# EAGLE design ToolHead (EAGLE 9.4.2)
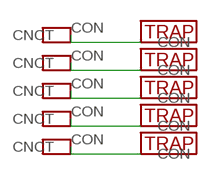
[diagram p0: schematic, sheet 1]

## Parts
U$1  MOLEX-LITE-TRAP  [MOLEX-LITE-TRAP]
U$2  MOLEX-LITE-TRAP  [MOLEX-LITE-TRAP]
U$3  MOLEX-LITE-TRAP  [MOLEX-LITE-TRAP]
U$4  MOLEX-LITE-TRAP  [MOLEX-LITE-TRAP]
U$5  MOLEX-LITE-TRAP  [MOLEX-LITE-TRAP]
U$6  SPRING-FINGER  [SPRING-FINGER]
U$7  SPRING-FINGER  [SPRING-FINGER]
U$8  SPRING-FINGER  [SPRING-FINGER]
U$9  SPRING-FINGER  [SPRING-FINGER]
U$10  SPRING-FINGER  [SPRING-FINGER]

## Nets
N$1: U$4.TRAP(CON) U$10.CON(CNCT)
N$2: U$3.TRAP(CON) U$9.CON(CNCT)
N$3: U$2.TRAP(CON) U$8.CON(CNCT)
N$4: U$1.TRAP(CON) U$7.CON(CNCT)
N$5: U$5.TRAP(CON) U$6.CON(CNCT)

## Library data of the parts
U$1-U$5 = MolexLiteTrap:MOLEX-LITE-TRAP
U$6-U$10 = MolexLiteTrap:SPRING-FINGER

## Board
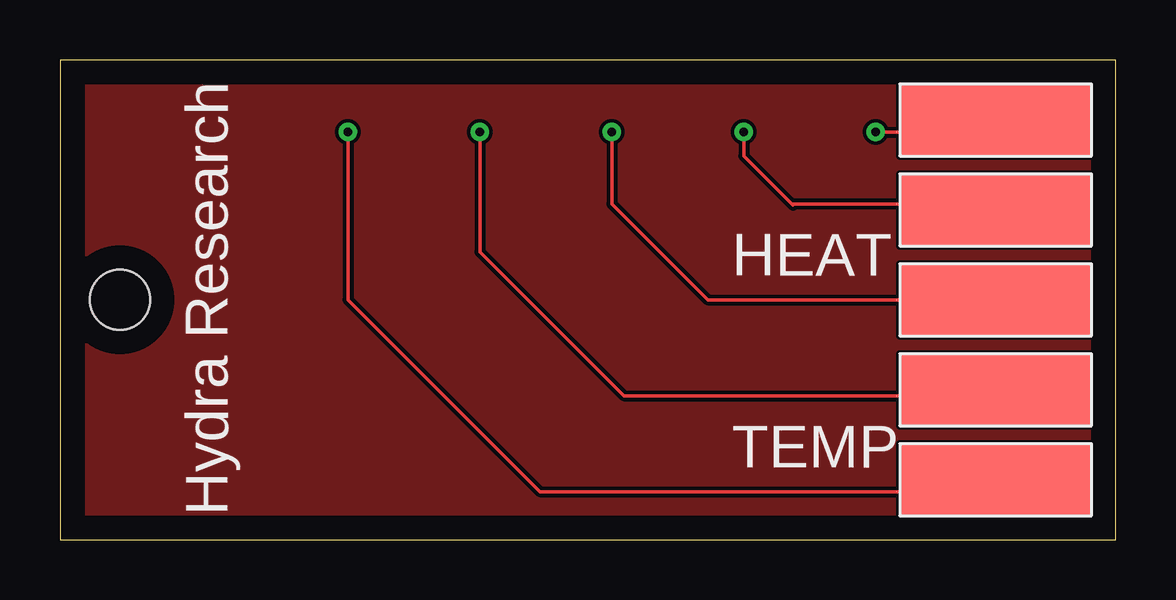
[diagram p1: board, top side]
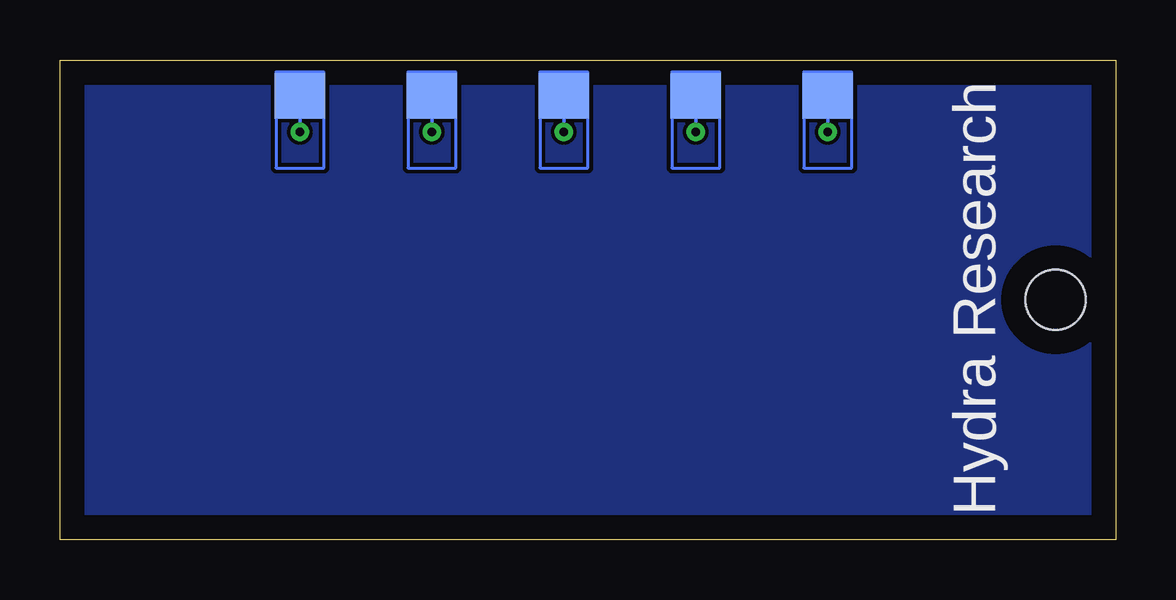
[diagram p2: board, bottom side, seen from below]

Size 44 x 20 mm. Coordinates in mm from the lower left corner, seen from the top.
Outline: 0,0 44,0 44,20 0,20 0,0
Copper layers (1*16): Top 0.035mm / dielectric 1.5mm / Bottom 0.035mm
Design rules "default": minimum track width 6mil, minimum drill 0.35mm, track to track 6mil, track to pad 6mil, pad to pad 6mil, via to via 6mil, smd to smd 6mil, copper to edge 40mil, drill to drill 6mil, minimum pad ring 10mil, minimum via ring 8mil, stop-mask expansion 4mil, vias tented up to drill 0mil, thermal gap 10mil
Holes 2.5 mm at 2.5,10

### Footprints (pad centres in the part's own frame; a part is rotated, then mirrored left to right if it is on the bottom)
MOLEX-LITE-TRAP = smd 8 x 3: TRAP 4,1.5
SPRING-FINGER = smd 1.9 x 2.1: CON 1,1

### Placement (x,y rotation side)
U$1  35,8.5 0 top
U$2  35,4.75 0 top
U$3  35,1 0 top
U$4  35,12.25 0 top
U$5  35,16 0 top
U$6  35,19.5 270 bottom
U$7  24,19.5 270 bottom
U$8  18.5,19.5 270 bottom
U$9  13,19.5 270 bottom
U$10  29.5,19.5 270 bottom

### Tracks (layer width: path | path; a pad name or v marks a point on that pad's centre or on a via)
CON
  pour Top: 0,20 44,20 44,0 0,0
  pour Bottom: 0,0 0,20 44,20 44,0
N$1  (via drill 0.35)
  Top 0.152: v28.5,17 28.5,16 30.5,14 | 30.5,14 36,14 36.25,13.75 U$4.TRAP | 30.5,14 30.56,13.94
  Bottom 0.152: U$10.CON v28.5,17
N$2  (via drill 0.35)
  Top 0.152: v12,17 12,10 20,2 38.5,2 U$3.TRAP
  Bottom 0.152: U$9.CON v12,17
N$3  (via drill 0.35)
  Top 0.152: v17.5,17 17.5,12 23.5,6 38.75,6 U$2.TRAP
  Bottom 0.152: U$8.CON v17.5,17
N$4  (via drill 0.35)
  Top 0.152: v23,17 23,14 27,10 U$1.TRAP
  Bottom 0.152: U$7.CON v23,17
N$5  (via drill 0.35)
  Top 0.152: U$5.TRAP 37.91,17 v34,17
  Bottom 0.152: U$6.CON v34,17

### Text on the board
tPlace: HEAT | TEMP | Hydra Research
bPlace: Hydra Research